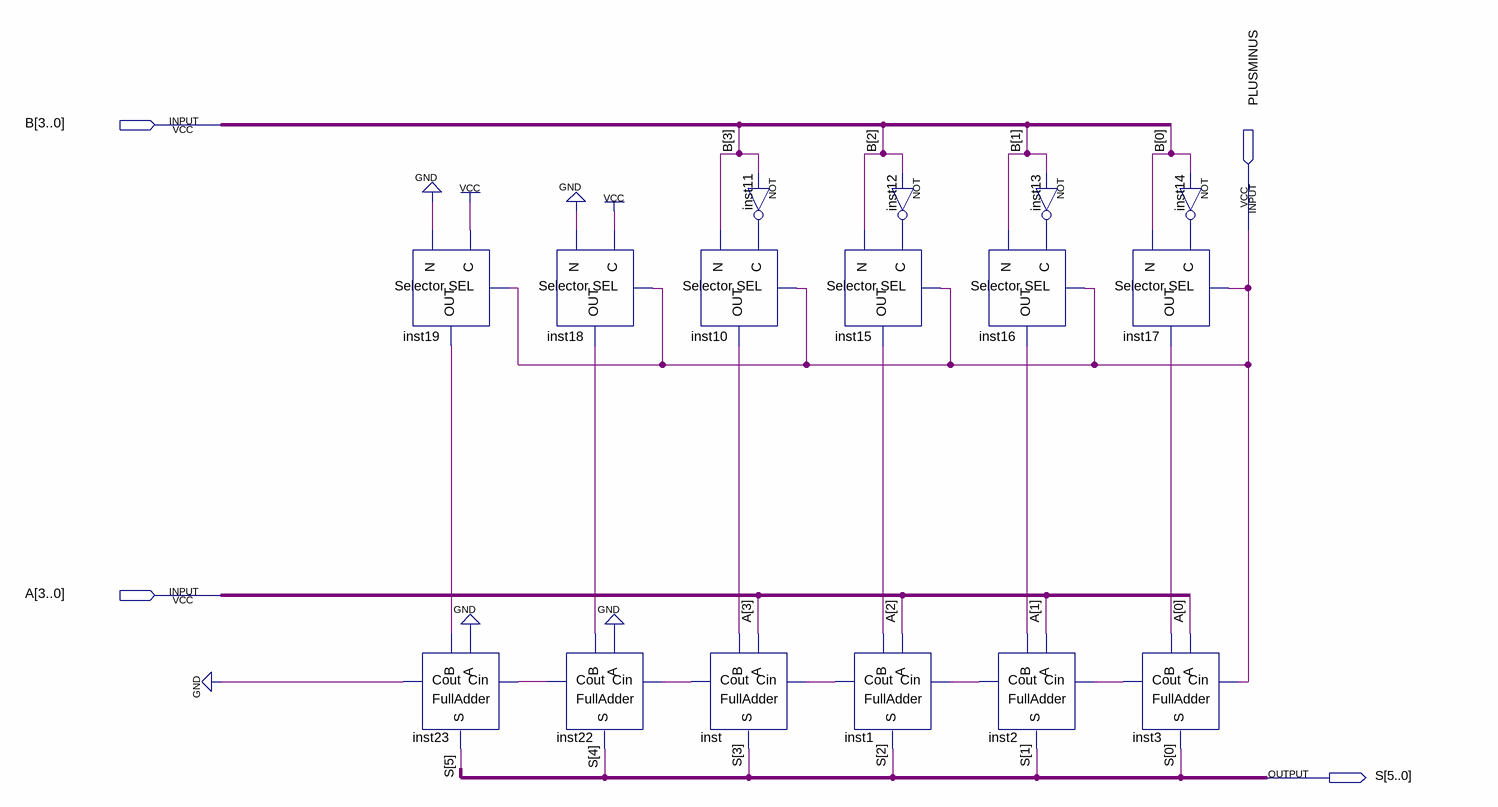
[diagram p0: schematic sheet]
// Quartus schematic SumSub6bit.bdf as structural Verilog: 16 symbols, 4 pins
module SumSub6bit (
  input  [3:0] B,
  input  PLUSMINUS,
  input  [3:0] A,
  output [5:0] S
);

  wire inst1_cout, inst2_cout, inst3_cout, inst10_out, inst11_out, inst12_out, inst13_out, inst14_out,
       inst15_out, inst16_out, inst17_out, inst18_out, inst19_out, inst22_cout, inst23_cout, inst_cout;

  Selector inst19 (.N(1'b0), .C(1'b1), .SEL(PLUSMINUS), .OUT(inst19_out));
  FullAdder inst23 (.B(inst19_out), .A(1'b0), .Cin(inst22_cout), .S(S[5]), .Cout(inst23_cout));
  Selector inst18 (.N(1'b0), .C(1'b1), .SEL(PLUSMINUS), .OUT(inst18_out));
  FullAdder inst22 (.B(inst18_out), .A(1'b0), .Cin(inst_cout), .S(S[4]), .Cout(inst22_cout));
  Selector inst10 (.N(B[3]), .C(inst11_out), .SEL(PLUSMINUS), .OUT(inst10_out));
  FullAdder inst (.B(inst10_out), .A(A[3]), .Cin(inst1_cout), .S(S[3]), .Cout(inst_cout));
  not inst11 (inst11_out, B[3]);
  not inst12 (inst12_out, B[2]);
  Selector inst15 (.N(B[2]), .C(inst12_out), .SEL(PLUSMINUS), .OUT(inst15_out));
  FullAdder inst1 (.B(inst15_out), .A(A[2]), .Cin(inst2_cout), .S(S[2]), .Cout(inst1_cout));
  not inst13 (inst13_out, B[1]);
  Selector inst16 (.N(B[1]), .C(inst13_out), .SEL(PLUSMINUS), .OUT(inst16_out));
  FullAdder inst2 (.B(inst16_out), .A(A[1]), .Cin(inst3_cout), .S(S[1]), .Cout(inst2_cout));
  Selector inst17 (.N(B[0]), .C(inst14_out), .SEL(PLUSMINUS), .OUT(inst17_out));
  not inst14 (inst14_out, B[0]);
  FullAdder inst3 (.B(inst17_out), .A(A[0]), .Cin(PLUSMINUS), .S(S[0]), .Cout(inst3_cout));
  // also tied to GND on the sheet: inst23_cout
endmodule
